# Altium schematic sheet Sheet3.SchDoc
size A; SheetNumber: 3; SheetTotal: 3
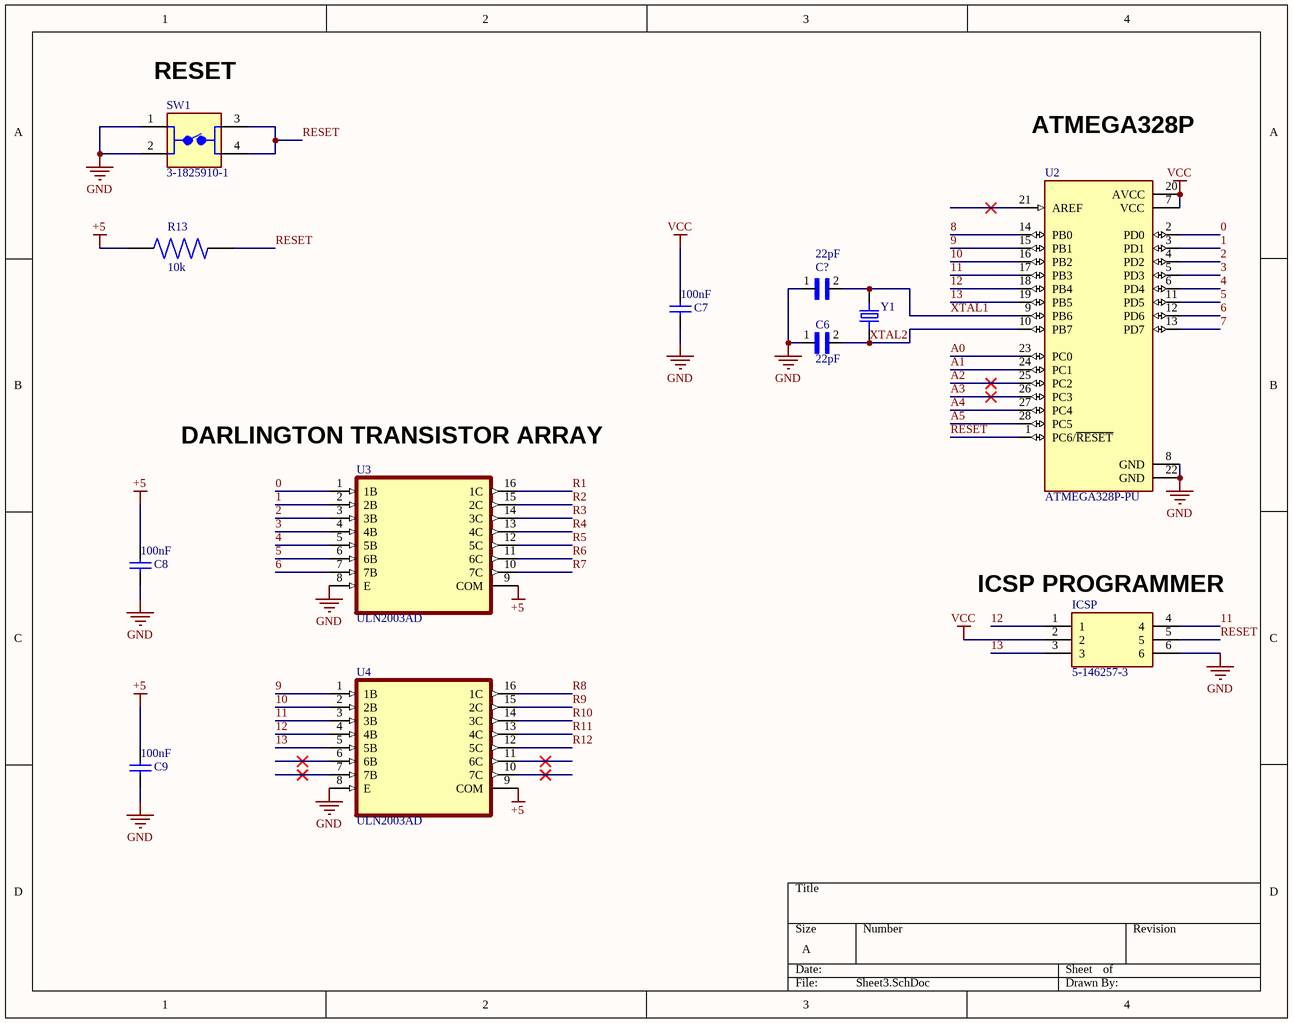
[diagram p0: Sheet3.SchDoc]

## Parts
C5  22pF  value C?  [CAPC2012X130N]
C6  22pF  [CAPC2012X130N]
C7  100nF  [WCAP-CSGP_0603_L1.6W0.8H0.8_Wave]
C8  100nF  [WCAP-CSGP_0603_L1.6W0.8H0.8_Wave]
C9  100nF  [WCAP-CSGP_0603_L1.6W0.8H0.8_Wave]
ICSP  5-146257-3  [TE_5-146257-3]
R13  10k  [RESC3216X70N]
SW1  3-1825910-1  [TE_3-1825910-1]
U2  ATMEGA328P-PU  [DIP794W46P254L2967H457Q28B]
U3  ULN2003AD  [SOIC127P600X175-16N]
U4  ULN2003AD  [SOIC127P600X175-16N]
Y1  (no value)  [XTAL_ECS-160-20-3X-TR]

## Nets
+5: C8.2 C9.2 R13.1 U3.9(COM) U4.9(COM)
GND: C5.1 C6.1 C7.1 C8.1 C9.1 ICSP.6 SW1.1 SW1.2 U2.8(GND) U2.22(GND) U3.8(E) U4.8(E)
VCC: C7.2 ICSP.2 U2.7(VCC) U2.20(AVCC)
0: U2.2(PD0) U3.1(1B)
1: U2.3(PD1) U3.2(2B)
2: U2.4(PD2) U3.3(3B)
3: U2.5(PD3) U3.4(4B)
4: U2.6(PD4) U3.5(5B)
5: U2.11(PD5) U3.6(6B)
6: U2.12(PD6) U3.7(7B)
7: U2.13(PD7)
8: U2.14(PB0)
9: U2.15(PB1) U4.1(1B)
10: U2.16(PB2) U4.2(2B)
11: ICSP.4 U2.17(PB3) U4.3(3B)
12: ICSP.1 U2.18(PB4) U4.4(4B)
13: ICSP.3 U2.19(PB5) U4.5(5B)
A0: U2.23(PC0)
A1: U2.24(PC1)
A2: U2.25(PC2)
A3: U2.26(PC3)
A4: U2.27(PC4)
A5: U2.28(PC5)
R1: U3.16(1C)
R2: U3.15(2C)
R3: U3.14(3C)
R4: U3.13(4C)
R5: U3.12(5C)
R6: U3.11(6C)
R7: U3.10(7C)
R8: U4.16(1C)
R9: U4.15(2C)
R10: U4.14(3C)
R11: U4.13(4C)
R12: U4.12(5C)
RESET: ICSP.5 R13.2 SW1.3 SW1.4 U2.1(PC6/~{RESET})
XTAL1: C5.2 U2.9(PB6) Y1.2
XTAL2: C6.2 U2.10(PB7) Y1.1

Not connected (* = marked no-connect by the designer): U2 21(AREF)*; U4 6(6B)* 7(7B)* 10(7C)* 11(6C)*

## Notes on the sheet
- (near SW1) RESET
- ATMEGA328P
- (near U3) DARLINGTON TRANSISTOR ARRAY
- (near ICSP) ICSP PROGRAMMER

## Library data of the parts
C5 C6 = 0805Y0500220JCT: Cap Cer 22pf 50v C0g/Np0 0805; MF: Syfer; Mouser-Purchase-URL: https://snapeda.com/shop?store=Mouser&id=1818858; Package: 2012 Knowles Syfer; Price: None; MP: 0805Y0500220JCT; Availability: Warning; SnapEDA_Link: https://www.snapeda.com/parts/0805Y0500220JCT/Syfer/view-part/1818858/?ref=snap; BuyPart: https://www.snapeda.com/parts/0805Y0500220JCT/Syfer/view-part/1818858/?ref=eda
  C6: Value: *
C7-C9 = 885012206071: WCAP-CSGP Multilayer Ceramic Chip Capacitor, General Purpose, size 0603, X7R, 100nF, 25VDC; Manufacturer: Wurth Elektronik; Case/Size Code: 0603; Capacitance Tolerance: +/-10%; Dissipation Factor: 3.5%; Insulation Resistance: 5GΩ; Rated Voltage (DC): 25V; Technical Reference: X7R0603104K025DFCT10000; Manufacturer Part Number: 885012206071; Category: Multilayer Ceramic Chip Capacitors; Match Code: WCAP-CSGP; ComponentLink1Description: Website Link; ComponentLink1URL: https://www.we-online.com/redexpert/article/885012206071?ad; ComponentLink2Description: Datasheet Link; ComponentLink2URL: https://www.we-online.com/redexpert/spec/885012206071?ad; Mount: Surface Mount; Operating Temperature Max: 125°C; Operating Temperature Min: -55°C; Packaging: Tape and Reel; Length: 1.6mm; Width: 0.8mm; Height: 0.8mm; Capacitance: 100nF; Ceramic Type: X7R
ICSP = 5-146257-3: Header; Breakaway; 0.100 x 0.100 in.; PC Board; Dual; 6; 0.025 in.; 0.12 in.; MF: TE Connectivity; EU_RoHS_Compliance: Compliant; SnapEDA_Link: https://www.snapeda.com/parts/5-146257-3/TE+Connectivity+AMP+Connectors/view-part/?ref=snap; Purchase-URL: https://pricing.snapeda.com/search/part/5-146257-3/?ref=eda; Package: None; MP: 5-146257-3; Price: None; Availability: In Stock; Check_prices: https://www.snapeda.com/parts/5-146257-3/TE+Connectivity+AMP+Connectors/view-part/?ref=eda; Value: *
R13 = FCR1206J10R: Res 1206 10 Ohm 5% 1/8W Â±500ppm/Â°C Molded SMD SMD T/R; Resistance: 10; Power_Rating: .125 W; MF: TE Connectivity; DigiKey-Purchase-URL: https://snapeda.com/shop?store=DigiKey&id=988597; Package: 1206; EU_RoHS_Compliance: Compliant with Exemptions; Tolerance: 5%; Value: *; MP: FCR1206J10R; Price: None; SnapEDA_Link: https://www.snapeda.com/parts/FCR1206J10R/TE%20Connectivity%20Passive%20Product/view-part/988597/?ref=snap; Mouser-Purchase-URL: https://snapeda.com/shop?store=Mouser&id=988597; Availability: Warning
SW1 = 3-1825910-1: Switch Push Button OFF (ON) SPST Round Button 0.05A 24VDC Momentary Contact PC Pins Thru-Hole; MF: TE Connectivity; Value: *; SnapEDA_Link: https://www.snapeda.com/parts/3-1825910-1/TE+Connectivity+ALCOSWITCH+Switches/view-part/?ref=snap; Purchase-URL: https://pricing.snapeda.com/search/part/3-1825910-1/?ref=eda; Availability: In Stock; Price: None; Package: None; Check_prices: https://www.snapeda.com/parts/3-1825910-1/TE+Connectivity+ALCOSWITCH+Switches/view-part/?ref=eda; MP: 3-1825910-1
U2 = ATMEGA328P-PU: ATmega Series 20 MHz 32 KB Flash 2 KB SRAM 8-Bit Microcontroller - DIP-28; MP: ATMEGA328P-PU; Package: None; Availability: Unavailable; Price: None; Value: *
U3 U4 = ULN2003AD: 50-V, 7-ch darlington transistor array, -20C to 70C; MF: Texas Instruments; Check_prices: https://www.snapeda.com/parts/ULN2003AD/Texas+Instruments/view-part/?ref=eda; SnapEDA_Link: https://www.snapeda.com/parts/ULN2003AD/Texas+Instruments/view-part/?ref=snap; Price: None; Availability: In Stock; Value: *; MP: ULN2003AD; Package: SOIC-16 Texas Instruments; Purchase-URL: https://pricing.snapeda.com/search/part/ULN2003AD/?ref=eda
Y1 = ECS-160-20-3X-TR: 16MHz Â±30ppm Crystal 20pF 50 Ohms HC-49/US; MF: ECS Inc.; Digi-Key_Part_Number: XC1776CT-ND; Digi-Key_Purchase_URL: https://www.digikey.com/product-detail/en/ecs-inc/ECS-160-20-3X-TR/XC1776CT-ND/2676640?utm_source=snapeda&utm_medium=aggregator&utm_campaign=symbol; Package: HC49/US ECS International; MP: ECS-160-20-3X-TR; Value: *; SnapEDA_Link: https://www.snapeda.com/parts/ECS-160-20-3X-TR/ECS%20Inc./view-part/561589/?ref=snap